# Altium schematic sheet input_output.SchDoc
size A4
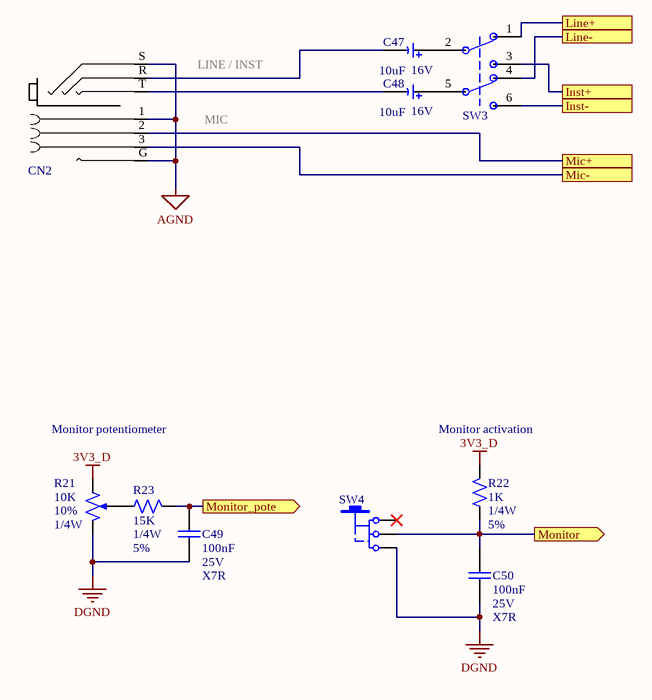
[diagram p0: input_output.SchDoc]

## Parts
C47  Valor: 10uF  tension: 16V  [CAP_Electrolytic]  (hidden comment: Capacitor polarizado)
C48  Valor: 10uF  tension: 16V  [CAP_Electrolytic]  (hidden comment: Capacitor polarizado)
C49  Valor: 100nF  tension: 25V  tolerancia: X7R  [C0805]  (hidden comment: Capacitor)
C50  Valor: 100nF  tension: 25V  tolerancia: X7R  [C0805]  (hidden comment: Capacitor)
CN2  XRL_Jack_Combo_stereo  [Combo XLR Jack]  (value not drawn)
R21  valor: 10K  Tolerancia: 10%  Potencia: 1/4W  [Header 3x1]  (hidden comment: Potenciometro)
R22  Valor: 1K  Potencia: 1/4W  Tolerancia: 5%  [R0805]  (hidden comment: Resistor)
R23  Valor: 15K  Potencia: 1/4W  Tolerancia: 5%  [R0805]  (hidden comment: Resistor)
SW3  Slide_SW_DPDT  [DPDT_SMD_Slide_90º]  (value not drawn)
SW4  TAC_SWITCH_4  [SPDT_SMD_90º]  (value not drawn)

## Ports
Inst+, Inst-, Line+, Line-, Mic+, Mic-, Monitor (out), Monitor_pote (out)

## Nets
3V3_D: R21.3(Right) R22.2
AGND: CN2.1 CN2.G CN2.S
DGND: C49.2 C50.2 R21.1(Left) SW4.3
Inst+: SW3.3 ; port Inst+
Inst-: SW3.6 ; port Inst-
Line+: SW3.1 ; port Line+
Line-: SW3.4 ; port Line-
Mic+: CN2.2 ; port Mic+
Mic-: CN2.3 ; port Mic-
Monitor: C50.1 R22.1 SW4.2 ; port Monitor
Monitor_pote: C49.1 R23.2 ; port Monitor_pote
NetC47_1: C47.1 SW3.2
NetC47_2: C47.2 CN2.R
NetC48_1: C48.1 SW3.5
NetC48_2: C48.2 CN2.T
NetR21_2: R21.2(Punto_medio) R23.1

Not connected (* = marked no-connect by the designer): SW4 1*

## Notes on the sheet
- LINE / INST
- MIC
- Monitor potentiometer
- (near R22) Monitor activation

## Library data of the parts
C49 C50 = Capacitor: Capacitor de placas paralelas; Encapsulado: 0805; Link: *; Fabricante: *
R21 = Potenciometer: Link: *; Fabricante: *
R22 R23 = Resistor: Resistencia; Fabricante: *
SW3 = Slide_SW_DPDT: Cod. Proveedor: CKN10722TR-ND; Proveedor: Digi-Key; Encapsulado: SMD; Fabricante: C&K; Link: https://www.digikey.com/product-detail/en/c-k/JS202011JAQN/CKN10722TR-ND/6137629
SW4 = SWITCH_3: Pulsador de 4 pines; Proveedor: Digi-Key; Cod. Proveedor: 563-1246-1-ND; Encapsulado: SMD; Fabricante: Nidec Copal Electronics; Link: https://www.digikey.com/product-detail/en/nidec-copal-electronics/CFPA-1FB4-A2T/563-1246-1-ND/2357767
C47 C48 = Capacitor polarizado: Link: *; Fabricante: *
CN2 = XRL_Jack_Combo_stereo: Cod. Proveedor: *; Encapsulado: *; Proveedor: *; Link: *; Fabricante: *